# EAGLE design Schematic (EAGLE 9.6.1)
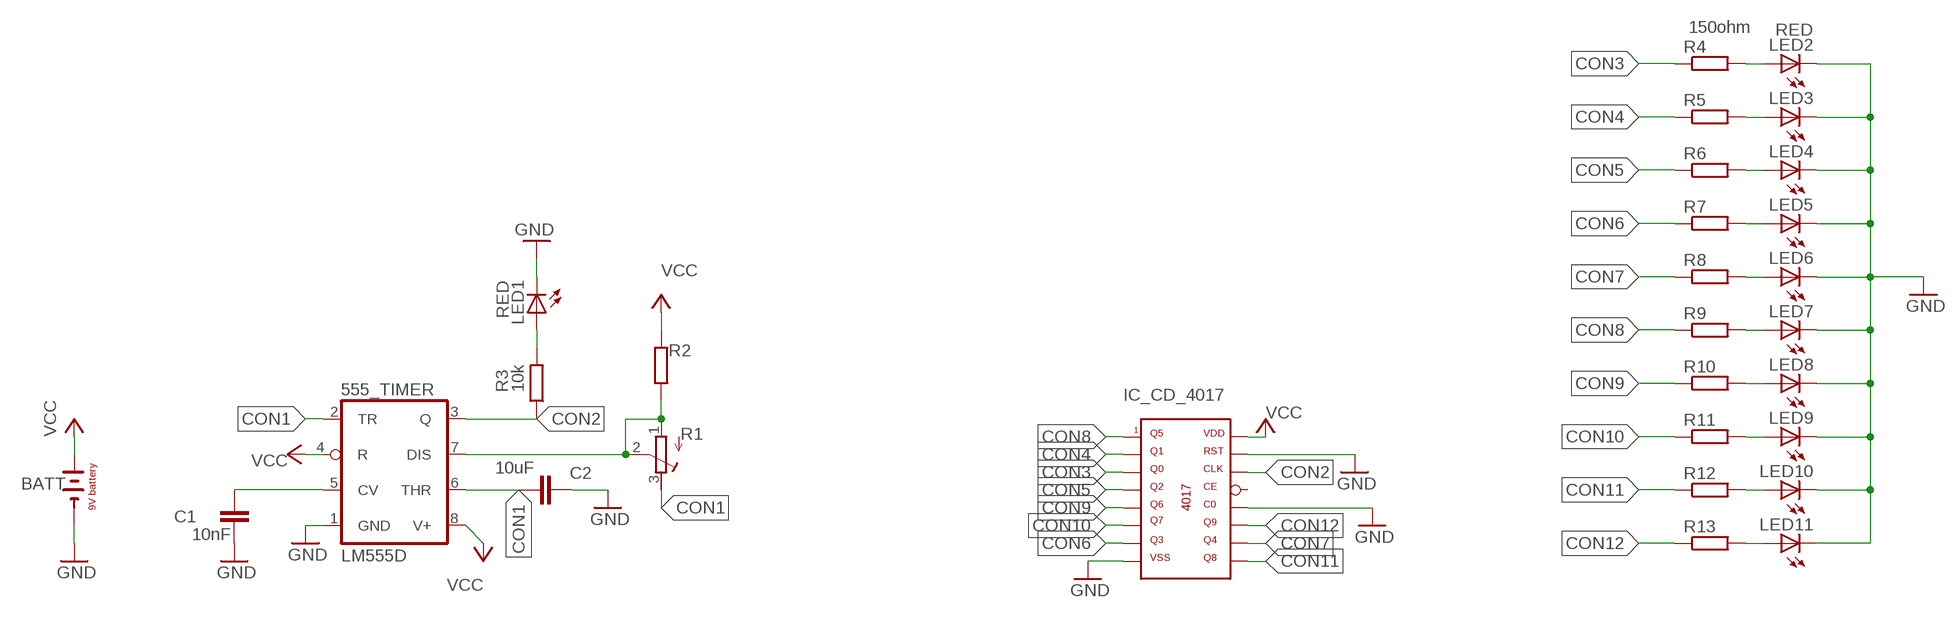
[diagram p0: schematic, sheet 1]

## Parts
555_TIMER  LM555D  [SO08]
BATT  -9VBAT  [BAT]
C1  10nF  C-EU025-025X050  [C025-025X050]
C2  10uF  C-EU025-025X050  [C025-025X050]
IC_CD_4017  -4017  [DIL16]
LED1  RED  LED3MM  [LED3MM]
LED2  RED  LED3MM  [LED3MM]
LED3  LED3MM  [LED3MM]
LED4  LED3MM  [LED3MM]
LED5  LED3MM  [LED3MM]
LED6  LED3MM  [LED3MM]
LED7  LED3MM  [LED3MM]
LED8  LED3MM  [LED3MM]
LED9  LED3MM  [LED3MM]
LED10  LED3MM  [LED3MM]
LED11  LED3MM  [LED3MM]
R1  R-TRIMM64P  [RTRIM64P]
R2  R-EU_0204/7  [0204/7]
R3  10k  R-EU_0204/7  [0204/7]
R4  150ohm  R-EU_0204/7  [0204/7]
R5  R-EU_0204/7  [0204/7]
R6  R-EU_0204/7  [0204/7]
R7  R-EU_0204/7  [0204/7]
R8  R-EU_0204/7  [0204/7]
R9  R-EU_0204/7  [0204/7]
R10  R-EU_0204/7  [0204/7]
R11  R-EU_0204/7  [0204/7]
R12  R-EU_0204/7  [0204/7]
R13  R-EU_0204/7  [0204/7]

## Nets
CON1: 555_TIMER.2(TR) 555_TIMER.6(THR) C2.1 R1.3(E)
CON2: 555_TIMER.3(Q) IC_CD_4017.14(CLK) R3.1
CON3: IC_CD_4017.3(Q0) R4.1
CON4: IC_CD_4017.2(Q1) R5.1
CON5: IC_CD_4017.4(Q2) R6.1
CON6: IC_CD_4017.7(Q3) R7.1
CON7: IC_CD_4017.10(Q4) R8.1
CON8: IC_CD_4017.1(Q5) R9.1
CON9: IC_CD_4017.5(Q6) R10.1
CON10: IC_CD_4017.6(Q7) R11.1
CON11: IC_CD_4017.9(Q8) R12.1
CON12: IC_CD_4017.11(Q9) R13.1
GND: 555_TIMER.1(GND) BATT.- C1.2 C2.2 IC_CD_4017.8(VSS) IC_CD_4017.12(C0) IC_CD_4017.15(RST) LED1.A LED1.K(C) LED2.K(C) LED3.K(C) LED4.K(C) LED5.K(C) LED6.K(C) LED7.K(C) LED8.K(C) LED9.K(C) LED10.K(C) LED11.K(C) R3.2
N$1: 555_TIMER.5(CV) C1.1
N$2: 555_TIMER.7(DIS) R1.1(A) R1.2(S) R2.1
N$3: LED2.A R4.2
N$4: LED3.A R5.2
N$5: LED4.A R6.2
N$6: LED5.A R7.2
N$7: LED6.A R8.2
N$8: LED7.A R9.2
N$9: LED8.A R10.2
N$10: LED9.A R11.2
N$11: LED10.A R12.2
N$12: LED11.A R13.2
VCC: 555_TIMER.4(R) 555_TIMER.8(V+) BATT.+ IC_CD_4017.16(VDD) R2.2
Unconnected: IC_CD_4017.13(CE)

## Library data of the parts
555_TIMER = adafruit:*555: TIMER Changed DIP package to have round (not oval) pin pads http://www.ladyada.net/library/pcb/eaglelibrary.html
BATT = tango:-9VBAT
C1 C2 = rcl:C-EU: CAPACITOR, European symbol; SPICEPREFIX: C
IC_CD_4017 = tango:-4017
LED1-LED11 = adafruit:LED: LED OSRAM: - CHIPLED LG R971, LG N971, LY N971, LG Q971, LY Q971, LO R971, LY R971 LH N974, LH R974 LS Q976, LO Q976, LY Q976 LO Q996 - Hyper CHIPLED LW Q18S LB Q993, LB Q99A, LB R99A - SideLED LS A670, LO A670, LY A670, LG A670, LP A670 LB A673, LV A673, LT A673, LW A673 LH A674 LY A675 LS A676, LA A676, LO A676, LY A676, LW A676 LS A679, LY A679, LG A679 - Hyper Micro SIDELED® LS Y876, LA Y876, LO Y876, LY Y876 LT Y87S - SmartLED LW L88C, LW L88S LB L89C, LB L89S, LG L890 LS L89K, LO L89K, LY L89K LS L896, LA L896, LO L896, LY L896 - TOPLED LS T670, LO T670, LY T670, LG T670, LP T670 LSG T670, LSP T670, LSY T670, LOP T670, LYG T670 LG T671, LOG T671, LSG T671 LB T673, LV T673, LT T673, LW T673 LH T674 LS T676, LA T676, LO T676, LY T676, LB T676, LH T676, LSB T676, LW T676 LB T67C, LV T67C, LT T67C, LS T67K, LO T67K, LY T67K, LW E67C LS E67B, LA E67B, LO E67B, LY E67B, LB E67C, LV E67C, LT E67C LW T67C LS T679, LY T679, LG T679 LS T770, LO T770, LY T770, LG T770, LP T770 LB T773, LV T773, LT T773, LW T773 LH T774 LS E675, LA E675, LY E675, LS T675 LS T776, LA T776, LO T776, LY T776, LB T776 LHGB T686 LT T68C, LB T68C - Hyper Mini TOPLED® LB M676 - Mini TOPLED Santana® LG M470 LS M47K, LO M47K, LY M47K Source: http://www.osram.convergy.de/
R1 = rcl:R-TRIMM: Trimm resistor; SPICEMODEL: X; SPICEPREFIXL: POT
R2-R13 = rcl:R-EU_: RESISTOR, European symbol; SPICEPREFIX: R

## Net classes
0 default: width 0.305 mm, drill 0.508 mm, clearance 0.254 mm

## Board
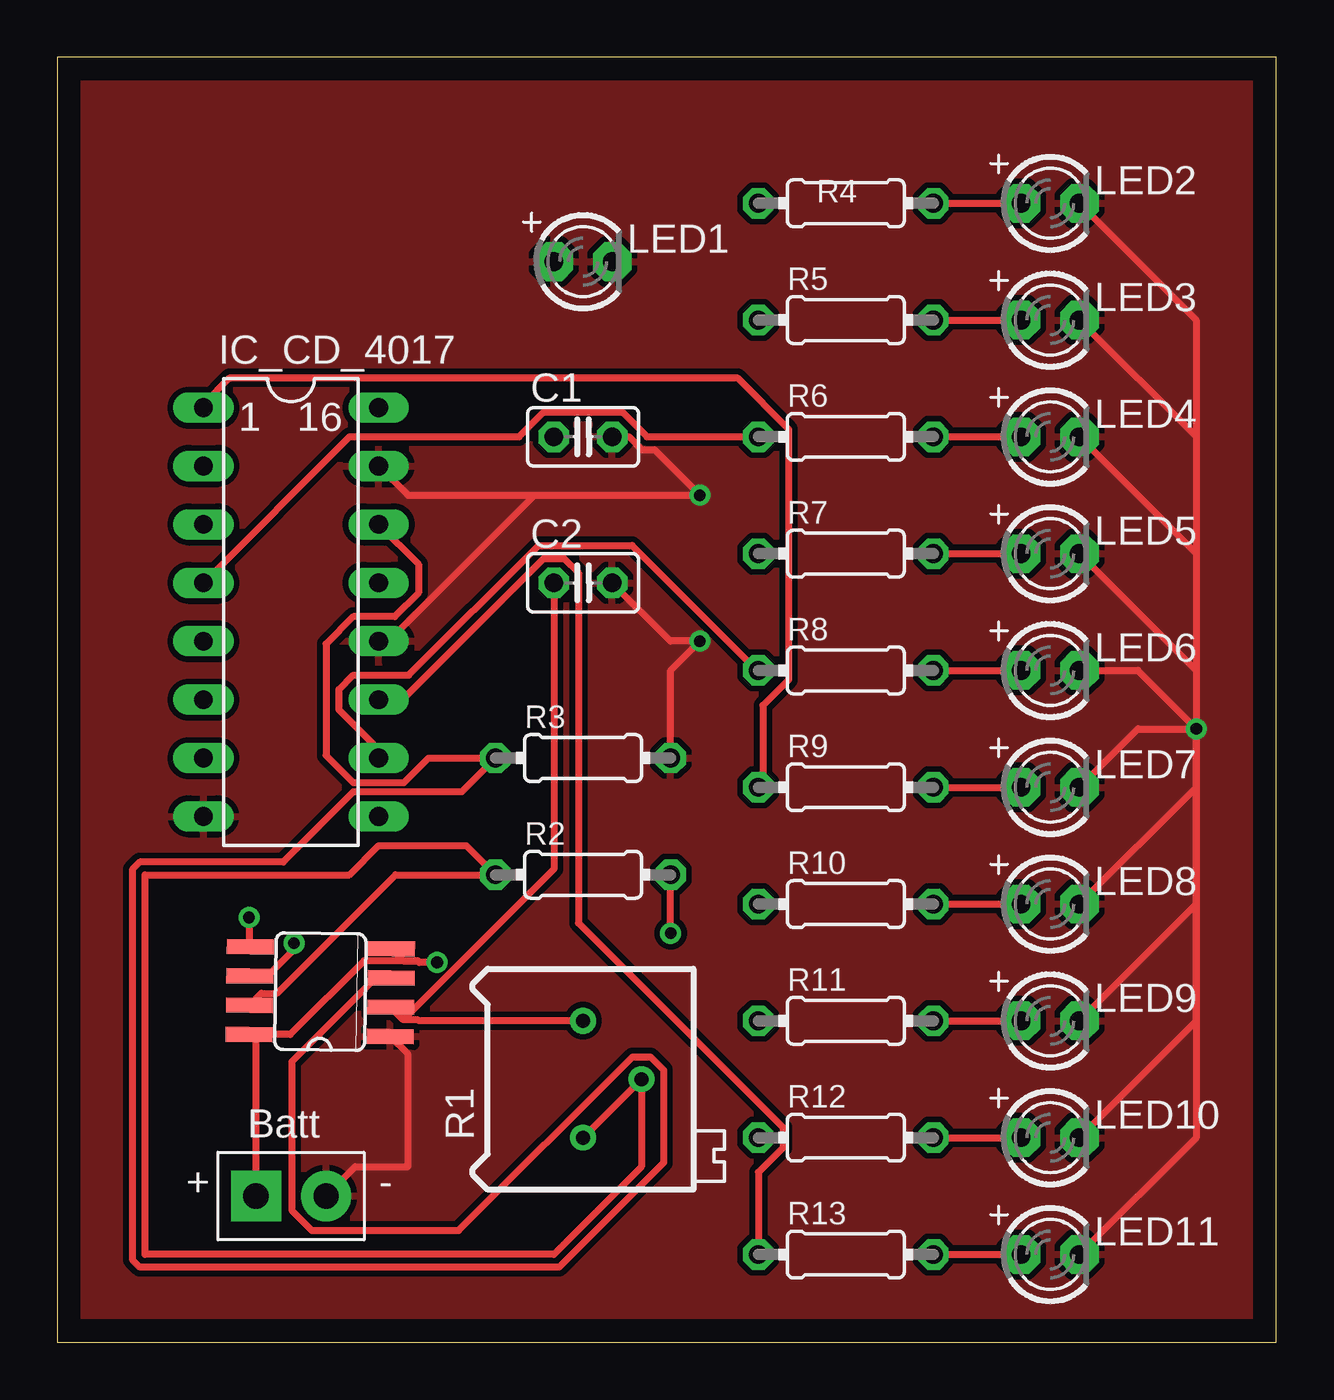
[diagram p1: board, top side]
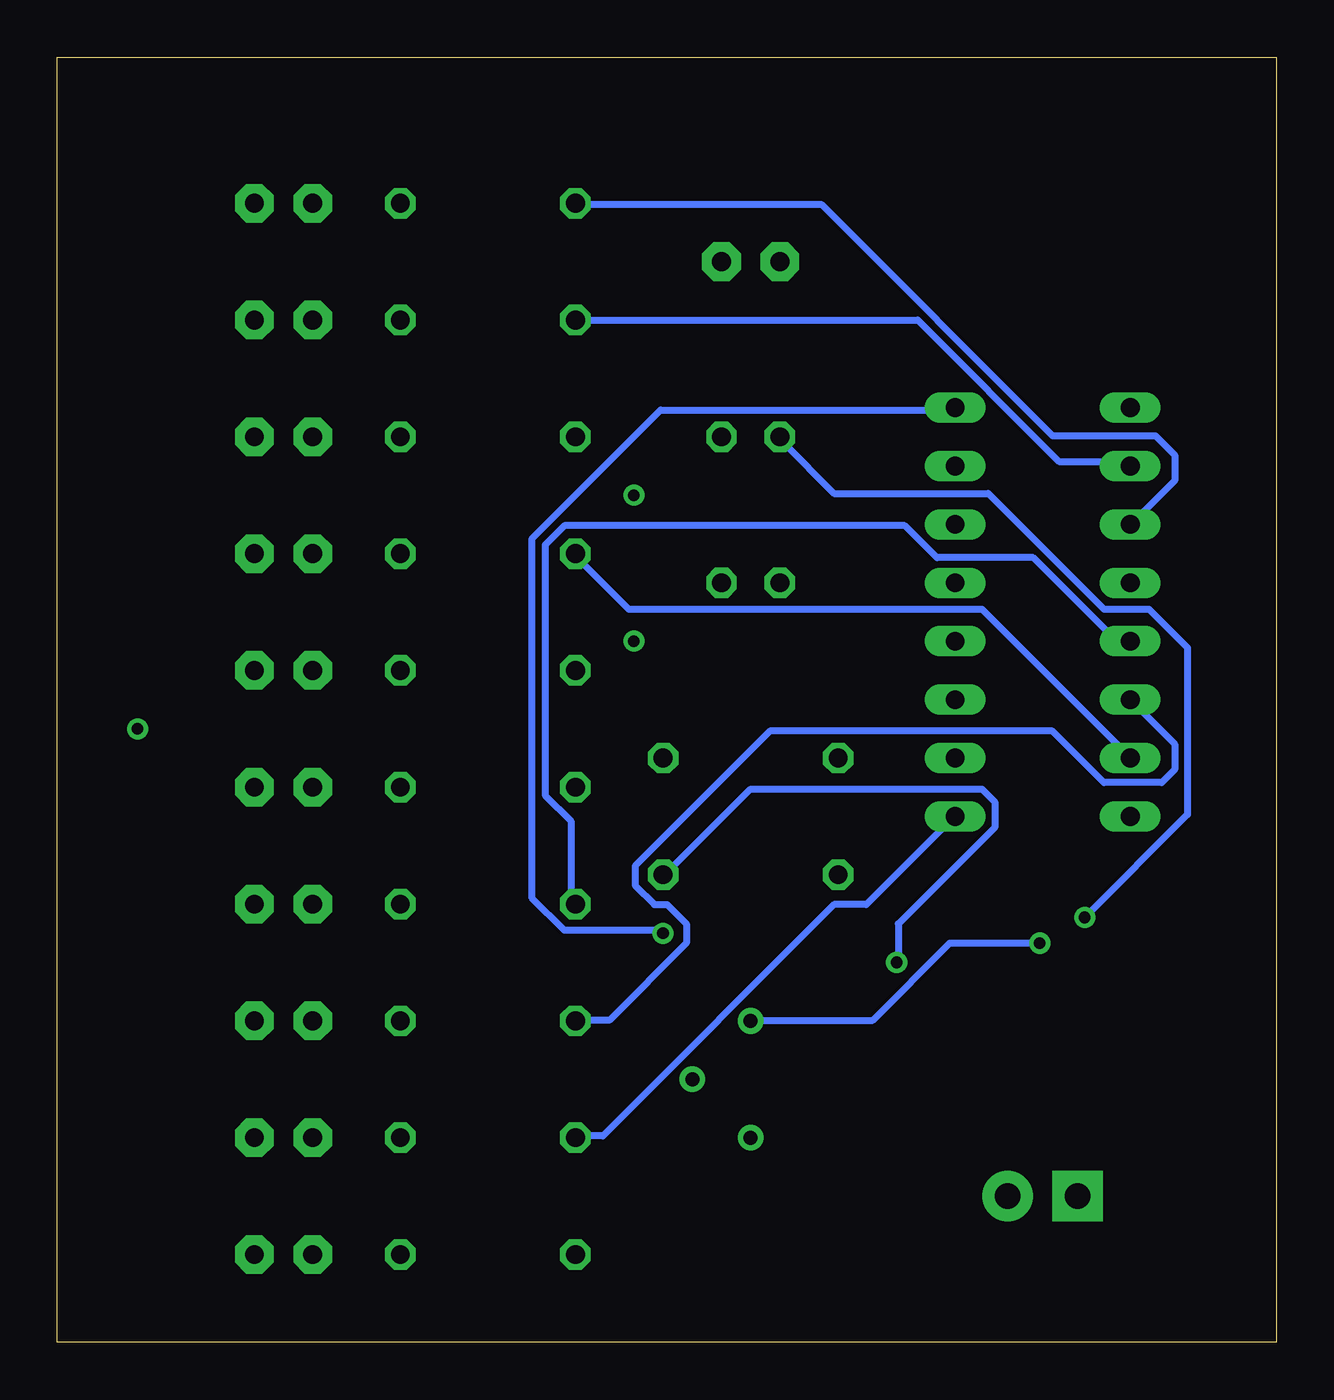
[diagram p2: board, bottom side, seen from below]

Size 53.01 x 55.87 mm. Coordinates in mm from the lower left corner, seen from the top.
Outline: 0,0 53.01,0 53.01,55.87 0,55.87 0,0
Copper layers (1*16): Top 0.035mm / dielectric 1.5mm / Bottom 0.035mm
Design rules "default": minimum track width 6mil, minimum drill 0.35mm, track to track 6mil, track to pad 6mil, pad to pad 6mil, via to via 6mil, smd to smd 6mil, copper to edge 40mil, drill to drill 6mil, minimum pad ring 10mil, minimum via ring 8mil, stop-mask expansion 4mil, vias tented up to drill 0mil, thermal gap 10mil
Holes 0.35 mm at -15.24,-7.62 76.2,-7.62 77.47,66.04 -16.51,66.04

### Footprints (pad centres in the part's own frame; a part is rotated, then mirrored left to right if it is on the bottom)
SO08 = smd 0.66 x 2.032: 1 -1.905,-3.073; 2 -0.635,-3.073; 3 0.635,-3.073; 4 1.905,-3.073; 5 1.905,3.073; 6 0.635,3.073; 7 -0.635,3.073; 8 -1.905,3.073
BAT = drill 1.1 pad 2.184 square: + -1.524,0 | drill 1.1 pad 2.184: - 1.524,0
C025-025X050 = drill 0.813 octagon: 1 -1.27,0; 2 1.27,0
DIL16 = drill 0.813 long: 1 -8.89,-3.81; 2 -6.35,-3.81; 3 -3.81,-3.81; 4 -1.27,-3.81; 5 1.27,-3.81; 6 3.81,-3.81; 7 6.35,-3.81; 8 8.89,-3.81; 9 8.89,3.81; 10 6.35,3.81; 11 3.81,3.81; 12 1.27,3.81; 13 -1.27,3.81; 14 -3.81,3.81; 15 -6.35,3.81; 16 -8.89,3.81
LED3MM = drill 0.813 pad 1.676 octagon: A -1.27,0; K 1.27,0
RTRIM64P = drill 0.61: 1 0,-2.54; 2 2.54,0; 3 0,2.54
0204/7 = drill 0.813 octagon: 1 -3.81,0; 2 3.81,0

### Placement (x,y rotation side)
555_TIMER  11.43,15.24 89.2 top
BATT  10.16,6.35 0 top
C1  22.86,39.37 0 top
C2  22.86,33.02 0 top
IC_CD_4017  10.16,31.75 270 top
LED1  22.86,46.99 0 top
LED2  43.18,49.53 0 top
LED3  43.18,44.45 0 top
LED4  43.18,39.37 0 top
LED5  43.18,34.29 0 top
LED6  43.18,29.21 0 top
LED7  43.18,24.13 0 top
LED8  43.18,19.05 0 top
LED9  43.18,13.97 0 top
LED10  43.18,8.89 0 top
LED11  43.18,3.81 0 top
R1  22.86,11.43 0 top
R2  22.86,20.32 0 top
R3  22.86,25.4 0 top
R4  34.29,49.53 0 top
R5  34.29,44.45 0 top
R6  34.29,39.37 0 top
R7  34.29,34.29 0 top
R8  34.29,29.21 0 top
R9  34.29,24.13 0 top
R10  34.29,19.05 0 top
R11  34.29,13.97 0 top
R12  34.29,8.89 0 top
R13  34.29,3.81 0 top

### Tracks (layer width: path | path; a pad name or v marks a point on that pad's centre or on a via)
CON1  (via drill 0.51)
  Top 0.305: 15.04,14.02 555_TIMER.2 | R1.3 15.71,13.97 15.66,14.02 15.04,14.02 | C2.1 21.59,20.58 15.04,14.02 | v10.29,17.35 10.29,17.07 9.17,15.95 8.61,15.95 555_TIMER.6
  Bottom 0.305: v10.29,17.35 14.2,17.35 17.55,14 22.86,14 R1.3
CON2
  Top 0.305: 555_TIMER.3 13.83,15.83 10.18,12.19 10.18,5.73 11.06,4.85 17.46,4.85 25,12.39 25.8,12.39 26.36,11.83 26.36,7.8 21.82,3.25 3.58,3.25 3.25,3.58 3.25,20.55 3.58,20.88 9.82,20.88 12.87,23.93 17.58,23.93 R3.1 16.14,25.4 15.07,24.33 12.87,24.33 11.68,25.52 11.68,30.36 12.87,31.55 14.67,31.55 15.7,32.58 15.7,33.83 IC_CD_4017.14
CON3
  Bottom 0.305: IC_CD_4017.3 6.1,35.79 4.42,37.47 4.42,38.58 5.26,39.42 9.73,39.42 19.79,49.48 30.4,49.48 R4.1
CON4
  Bottom 0.305: R5.1 15.6,44.45 9.45,38.3 6.38,38.3 IC_CD_4017.2
CON5
  Top 0.305: IC_CD_4017.4 12.7,39.37 20.08,39.37 21.15,40.44 24.57,40.44 25.64,39.37 R6.1
CON6
  Bottom 0.305: IC_CD_4017.7 6.38,25.45 12.8,31.88 28.17,31.88 30.4,34.11 R7.1
CON7
  Top 0.305: IC_CD_4017.10 13.97,25.77 12.24,27.5 12.24,28.38 12.87,29.01 15.28,29.01 20.92,34.65 25,34.65 30.43,29.21 R8.1
CON8
  Top 0.305: R9.1 30.68,24.33 30.68,27.69 31.8,28.8 31.8,39.7 29.57,41.94 7.49,41.94 6.38,40.82 IC_CD_4017.1
CON9
  Bottom 0.305: IC_CD_4017.5 6.93,30.48 10.57,34.11 14.76,34.11 16.15,35.51 30.96,35.51 31.8,34.67 31.8,23.77 30.68,22.66 30.68,19.3 R10.1
CON10
  Bottom 0.305: IC_CD_4017.6 4.42,26.01 4.42,24.89 4.98,24.33 7.49,24.33 9.73,26.57 22.02,26.57 27.89,20.7 27.89,19.86 27.05,19.02 26.49,19.02 25.65,18.19 25.65,17.35 29.01,14 30.4,14 R11.1
CON11
  Bottom 0.305: R12.1 30.4,8.97 29.29,8.97 19.23,19.02 17.83,19.02 14.2,22.66 IC_CD_4017.9
CON12
  Top 0.305: R13.1 30.48,7.38 31.55,8.45 31.55,9.33 22.66,18.22 22.66,33.46 22.03,34.09 21.15,34.09 15,27.94 IC_CD_4017.11
GND  (via drill 0.51)
  Top 0.305: BATT.- 12.95,7.62 15.24,7.62 15.24,12.53 555_TIMER.1 | R3.2 26.67,29.21 v27.94,30.48 26.67,30.48 C2.2 | v49.53,26.67 49.53,8.89 LED11.K | LED10.K 49.53,13.97 v49.53,26.67 | LED9.K 49.53,19.05 v49.53,26.67 | LED7.K 46.99,26.67 v49.53,26.67 | LED8.K 49.53,24.13 v49.53,26.67 | LED6.K 46.99,29.21 v49.53,26.67 | LED5.K 49.53,29.21 | 49.53,29.21 v49.53,26.67 | LED4.K 49.53,34.29 49.53,29.21 | LED3.K 49.53,39.37 v49.53,26.67 | LED2.K 49.53,44.45 v49.53,26.67 | C1.2 24.85,39.37 25.41,38.81 25.96,38.81 v27.94,36.83 | IC_CD_4017.12 14.48,30.99 14.9,30.99 20.74,36.83 v27.94,36.83 | IC_CD_4017.15 15.24,36.83 v27.94,36.83
  pour Top: -19.05,68.58 -19.05,-11.43 82.55,-11.43 82.55,68.58
N$1  (via drill 0.51)
  Top 0.305: v8.33,18.47 8.33,17.35 555_TIMER.5
  Bottom 0.305: v8.33,18.47 3.86,22.94 3.86,30.2 5.54,31.88 7.49,31.88 12.52,36.91 19.23,36.91 21.46,39.14 C1.1
N$2
  Top 0.305: 555_TIMER.7 8.86,15.16 9.55,15.16 14.7,20.32 R2.1 17.78,21.59 13.97,21.59 12.7,20.32 3.81,20.32 3.81,3.81 21.59,3.81 25.4,7.62 R1.2 R1.1
N$3
  Top 0.305: R4.2 LED2.A
N$4
  Top 0.305: R5.2 LED3.A
N$5
  Top 0.305: R6.2 LED4.A
N$6
  Top 0.305: R7.2 LED5.A
N$7
  Top 0.305: R8.2 LED6.A
N$8
  Top 0.305: R9.2 LED7.A
N$9
  Top 0.305: R10.2 LED8.A
N$10
  Top 0.305: R11.2 LED9.A
N$11
  Top 0.305: R12.2 LED10.A
N$12
  Top 0.305: R13.2 LED11.A
VCC  (via drill 0.51)
  Top 0.305: BATT.+ 8.64,13.07 555_TIMER.8 10.12,13.38 13.33,16.59 15.67,16.59 15.7,16.56 | 555_TIMER.4 15.07,16.56 15.7,16.56 | 15.7,16.56 15.75,16.51 v16.51,16.51 | v26.67,17.78 R2.2
  Bottom 0.305: IC_CD_4017.16 14.2,40.54 26.77,40.54 32.36,34.95 32.36,19.3 30.96,17.91 26.77,17.91 v26.67,17.78 | v16.51,16.51 16.43,16.51 16.43,18.19 12.24,22.38 12.24,23.49 12.8,24.05 22.86,24.05 26.49,20.42 R2.2